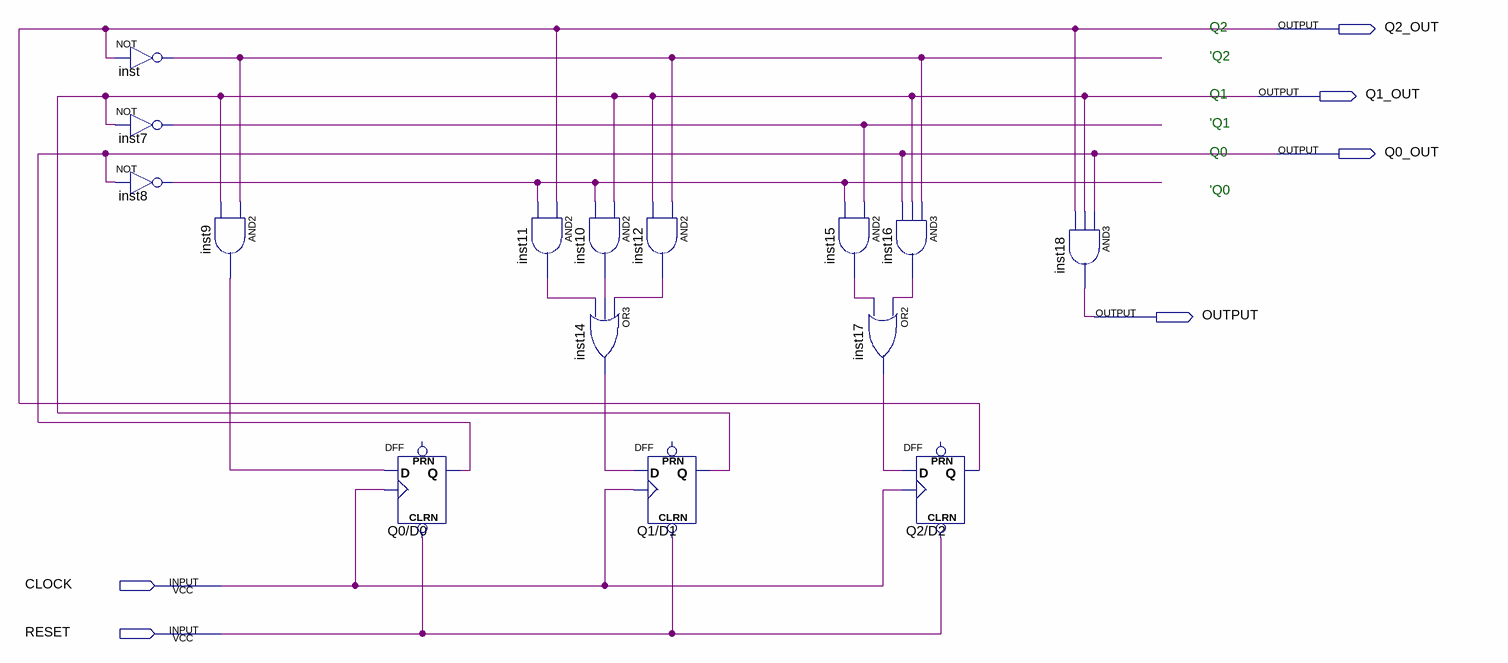
[diagram p0: schematic sheet]
// Quartus schematic modulo6.bdf as structural Verilog: 15 symbols, 6 pins
module modulo6 (
  input  CLOCK,
  input  RESET,
  output Q2_OUT,
  output Q1_OUT,
  output Q0_OUT,
  output OUTPUT
);

  wire inst7_out, inst8_out, inst9_out, inst10_out, inst11_out, inst12_out, inst14_out, inst15_out,
       inst16_out, inst17_out, inst_out;

  not inst (inst_out, Q2_OUT);
  not inst7 (inst7_out, Q1_OUT);
  not inst8 (inst8_out, Q0_OUT);
  and inst9 (inst9_out, inst_out, Q1_OUT);
  DFF \Q0/D0  (.CLRN(RESET), .CLK(CLOCK), .D(inst9_out), .Q(Q0_OUT));  // open: PRN
  and inst11 (inst11_out, Q2_OUT, inst8_out);
  and inst10 (inst10_out, Q1_OUT, inst8_out);
  or inst14 (inst14_out, inst12_out, inst10_out, inst11_out);
  and inst12 (inst12_out, inst_out, Q1_OUT);
  DFF \Q1/D1  (.CLRN(RESET), .CLK(CLOCK), .D(inst14_out), .Q(Q1_OUT));  // open: PRN
  and inst15 (inst15_out, inst7_out, inst8_out);
  and inst16 (inst16_out, inst_out, Q1_OUT, Q0_OUT);
  or inst17 (inst17_out, inst16_out, inst15_out);
  DFF \Q2/D2  (.CLRN(RESET), .CLK(CLOCK), .D(inst17_out), .Q(Q2_OUT));  // open: PRN
  and inst18 (OUTPUT, Q0_OUT, Q1_OUT, Q2_OUT);

  // Notes on the sheet:
  //   Q2
  //   'Q2
  //   Q1
  //   'Q1
  //   Q0
  //   'Q0
endmodule
